# Altium schematic sheet ZynqPS.SchDoc: ZynqProcessorSystem
size A3; Author: Carlos Barreiro; Organization: Escuela Técnica Superior de Ingeniería de Sistemas Informáticos de la Universidad Politécnica de Madrid; Address1: Campus Sur de la Universidad Politécnica de Madrid; Address2: Calle de Alan Turing, s/nº; Address3: Madrid 28031; Address4: España; DocumentNumber: 3; Revision: A; SheetNumber: 3; SheetTotal: 16
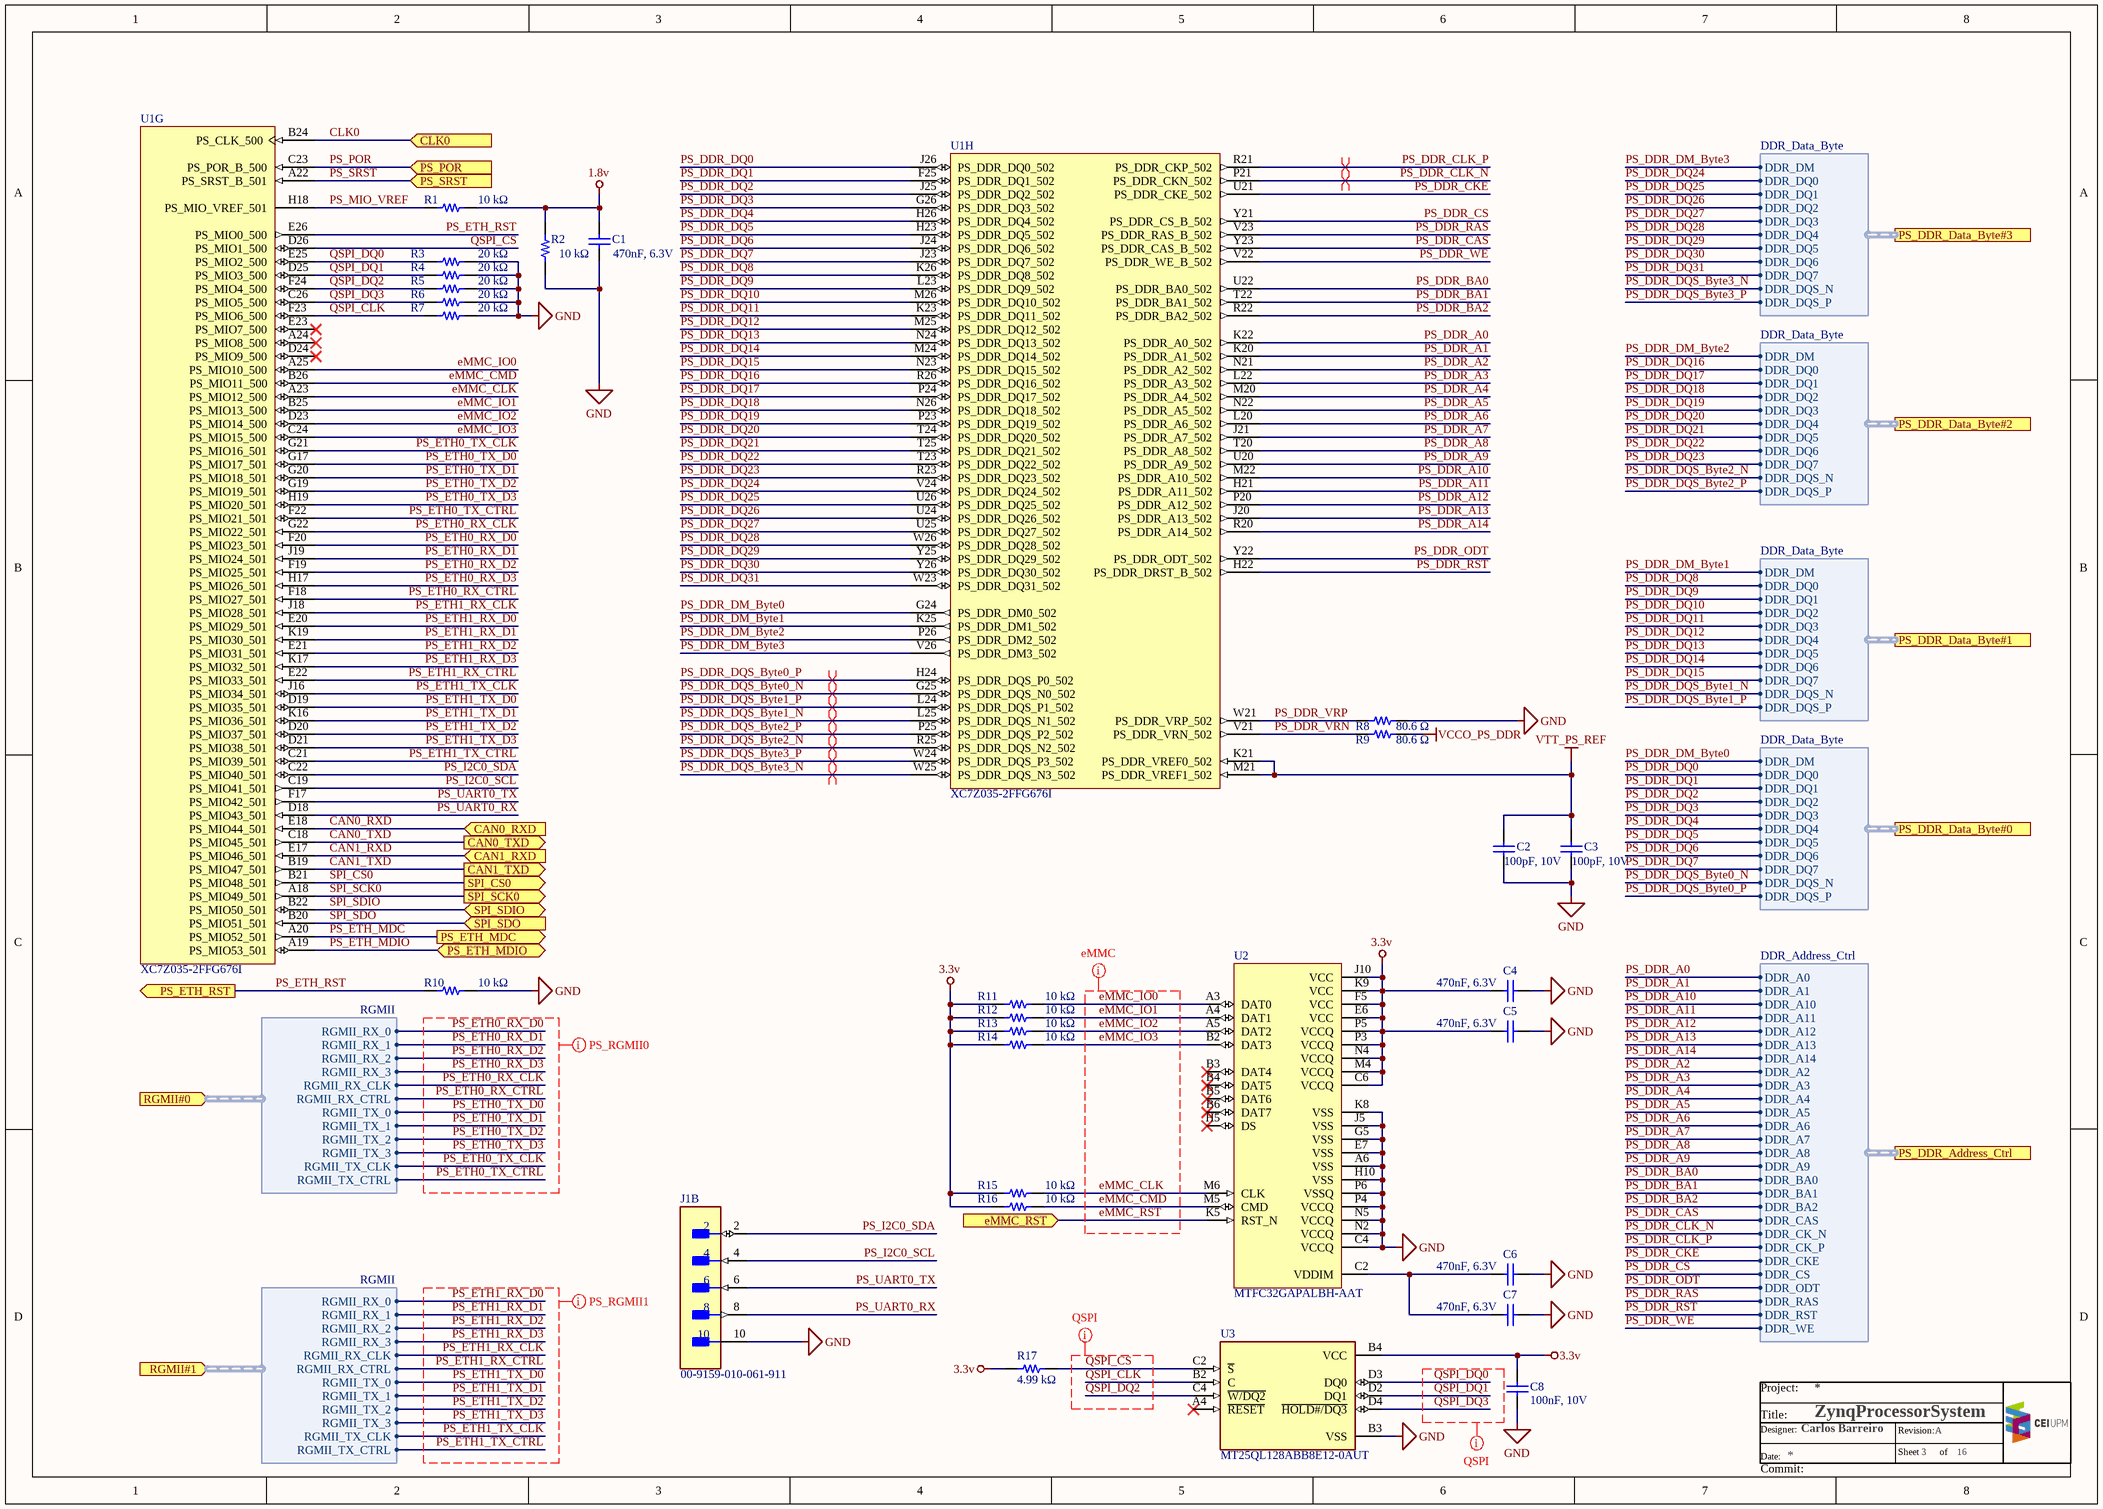
[diagram p0: ZynqPS.SchDoc]

## Parts
C1  470nF, 6.3V  [WURTH_WCAP-CSGP_0402]
C2  100pF, 10V  [WURTH_WCAP-CSGP_0402]
C3  100pF, 10V  [WURTH_WCAP-CSGP_0402]
C4  470nF, 6.3V  [WURTH_WCAP-CSGP_0402]
C5  470nF, 6.3V  [WURTH_WCAP-CSGP_0402]
C6  470nF, 6.3V  [WURTH_WCAP-CSGP_0402]
C7  470nF, 6.3V  [WURTH_WCAP-CSGP_0402]
C8  100nF, 10V  [WURTH_WCAP-CSGP_0402]
J1  00-9159-010-061-911  [KYOCERA_00-9159-010-061-911]  (part B of 2)
R1  10 kΩ  [PANASONIC_ERJ2G_0402]
R2  10 kΩ  [PANASONIC_ERJ2G_0402]
R3  20 kΩ  [PANASONIC_ERJ2G_0402]
R4  20 kΩ  [PANASONIC_ERJ2G_0402]
R5  20 kΩ  [PANASONIC_ERJ2G_0402]
R6  20 kΩ  [PANASONIC_ERJ2G_0402]
R7  20 kΩ  [PANASONIC_ERJ2G_0402]
R8  80.6 Ω  [PANASONIC_ERJ2G_0402]
R9  80.6 Ω  [PANASONIC_ERJ2G_0402]
R10  10 kΩ  [PANASONIC_ERJ2G_0402]
R11  10 kΩ  [PANASONIC_ERJ2G_0402]
R12  10 kΩ  [PANASONIC_ERJ2G_0402]
R13  10 kΩ  [PANASONIC_ERJ2G_0402]
R14  10 kΩ  [PANASONIC_ERJ2G_0402]
R15  10 kΩ  [PANASONIC_ERJ2G_0402]
R16  10 kΩ  [PANASONIC_ERJ2G_0402]
R17  4.99 kΩ  [PANASONIC_ERJ2G_0402]
U1  XC7Z035-2FFG676I  [XILINX_FBG676]  (parts G,H of 13)
U2  MTFC32GAPALBH-AAT  [Micron_BH]
U3  MT25QL128ABB8E12-0AUT  [Micron_RW]

## Ports
CAN0_RXD (in), CAN0_TXD (out), CAN1_RXD (in), CAN1_TXD (out), CLK0 (in), eMMC_RST (in), PS_DDR_Address_Ctrl (harness DDR_Address_Ctrl), PS_DDR_Data_Byte#0 (harness DDR_Data_Byte), PS_DDR_Data_Byte#1 (harness DDR_Data_Byte), PS_DDR_Data_Byte#2 (harness DDR_Data_Byte), PS_DDR_Data_Byte#3 (harness DDR_Data_Byte), PS_ETH_MDC (out), PS_ETH_MDIO (bidir), PS_ETH_RST (out), PS_POR (in), PS_SRST (in), RGMII#0 (in, harness RGMII), RGMII#1 (in, harness RGMII), SPI_CS0 (out), SPI_SCK0 (out), SPI_SDIO (bidir), SPI_SDO (in)

## Harnesses
DDR_Address_Ctrl: DDR_A0, DDR_A1, DDR_A10, DDR_A11, DDR_A12, DDR_A13, DDR_A14, DDR_A2, DDR_A3, DDR_A4, DDR_A5, DDR_A6, DDR_A7, DDR_A8, DDR_A9, DDR_BA0, DDR_BA1, DDR_BA2, DDR_CAS, DDR_CK_N, DDR_CK_P, DDR_CKE, DDR_CS, DDR_ODT, DDR_RAS, DDR_RST, DDR_WE
DDR_Data_Byte: DDR_DM, DDR_DQ0, DDR_DQ1, DDR_DQ2, DDR_DQ3, DDR_DQ4, DDR_DQ5, DDR_DQ6, DDR_DQ7, DDR_DQS_N, DDR_DQS_P
RGMII: RGMII_RX_0, RGMII_RX_1, RGMII_RX_2, RGMII_RX_3, RGMII_RX_CLK, RGMII_RX_CTRL, RGMII_TX_0, RGMII_TX_1, RGMII_TX_2, RGMII_TX_3, RGMII_TX_CLK, RGMII_TX_CTRL

## Nets
1.8v: C1.1 R1.1 R2.2
3.3v: C4.1 C5.1 C8.2 R11.2 R12.2 R13.2 R14.2 R15.2 R16.2 R17.1 U2.C6(VCCQ) U2.E6(VCC) U2.F5(VCC) U2.J10(VCC) U2.K9(VCC) U2.M4(VCCQ) U2.N4(VCCQ) U2.P3(VCCQ) U2.P5(VCCQ) U3.B4(VCC)
GND: C1.2 C2.1 C3.1 C4.2 C5.2 C6.2 C7.2 C8.1 J1.10 R2.1 R3.2 R4.2 R5.2 R6.2 R7.2 R8.2 R10.1 U2.A6(VSS) U2.C4(VCCQ) U2.E7(VSS) U2.G5(VSS) U2.H10(VSS) U2.J5(VSS) U2.K8(VSS) U2.N2(VCCQ) U2.N5(VCCQ) U2.P4(VCCQ) U2.P6(VSSQ) U3.B3(VSS)
VCCO_PS_DDR: R9.2
VTT_PS_REF: C2.2 C3.2 U1.K21(PS_DDR_VREF0_502) U1.M21(PS_DDR_VREF1_502)
CAN0_RXD: U1.E18(PS_MIO44_501) ; port CAN0_RXD
CAN0_TXD: U1.C18(PS_MIO45_501) ; port CAN0_TXD
CAN1_RXD: U1.E17(PS_MIO46_501) ; port CAN1_RXD
CAN1_TXD: U1.B19(PS_MIO47_501) ; port CAN1_TXD
CLK0: U1.B24(PS_CLK_500) ; port CLK0
eMMC_CLK: R15.1 U1.A23(PS_MIO12_500) U2.M6(CLK)
eMMC_CMD: R16.1 U1.B26(PS_MIO11_500) U2.M5(CMD)
eMMC_IO0: R11.1 U1.A25(PS_MIO10_500) U2.A3(DAT0)
eMMC_IO1: R12.1 U1.B25(PS_MIO13_500) U2.A4(DAT1)
eMMC_IO2: R13.1 U1.D23(PS_MIO14_500) U2.A5(DAT2)
eMMC_IO3: R14.1 U1.C24(PS_MIO15_500) U2.B2(DAT3)
eMMC_RST: U2.K5(RST_N) ; port eMMC_RST
PS_DDR_A0: U1.K22(PS_DDR_A0_502) ; port PS_DDR_Address_Ctrl.DDR_A0
PS_DDR_A1: U1.K20(PS_DDR_A1_502) ; port PS_DDR_Address_Ctrl.DDR_A1
PS_DDR_A2: U1.N21(PS_DDR_A2_502) ; port PS_DDR_Address_Ctrl.DDR_A2
PS_DDR_A3: U1.L22(PS_DDR_A3_502) ; port PS_DDR_Address_Ctrl.DDR_A3
PS_DDR_A4: U1.M20(PS_DDR_A4_502) ; port PS_DDR_Address_Ctrl.DDR_A4
PS_DDR_A5: U1.N22(PS_DDR_A5_502) ; port PS_DDR_Address_Ctrl.DDR_A5
PS_DDR_A6: U1.L20(PS_DDR_A6_502) ; port PS_DDR_Address_Ctrl.DDR_A6
PS_DDR_A7: U1.J21(PS_DDR_A7_502) ; port PS_DDR_Address_Ctrl.DDR_A7
PS_DDR_A8: U1.T20(PS_DDR_A8_502) ; port PS_DDR_Address_Ctrl.DDR_A8
PS_DDR_A9: U1.U20(PS_DDR_A9_502) ; port PS_DDR_Address_Ctrl.DDR_A9
PS_DDR_A10: U1.M22(PS_DDR_A10_502) ; port PS_DDR_Address_Ctrl.DDR_A10
PS_DDR_A11: U1.H21(PS_DDR_A11_502) ; port PS_DDR_Address_Ctrl.DDR_A11
PS_DDR_A12: U1.P20(PS_DDR_A12_502) ; port PS_DDR_Address_Ctrl.DDR_A12
PS_DDR_A13: U1.J20(PS_DDR_A13_502) ; port PS_DDR_Address_Ctrl.DDR_A13
PS_DDR_A14: U1.R20(PS_DDR_A14_502) ; port PS_DDR_Address_Ctrl.DDR_A14
PS_DDR_BA0: U1.U22(PS_DDR_BA0_502) ; port PS_DDR_Address_Ctrl.DDR_BA0
PS_DDR_BA1: U1.T22(PS_DDR_BA1_502) ; port PS_DDR_Address_Ctrl.DDR_BA1
PS_DDR_BA2: U1.R22(PS_DDR_BA2_502) ; port PS_DDR_Address_Ctrl.DDR_BA2
PS_DDR_CAS: U1.Y23(PS_DDR_CAS_B_502) ; port PS_DDR_Address_Ctrl.DDR_CAS
PS_DDR_CKE: U1.U21(PS_DDR_CKE_502) ; port PS_DDR_Address_Ctrl.DDR_CKE
PS_DDR_CLK_N: U1.P21(PS_DDR_CKN_502) ; port PS_DDR_Address_Ctrl.DDR_CK_N
PS_DDR_CLK_P: U1.R21(PS_DDR_CKP_502) ; port PS_DDR_Address_Ctrl.DDR_CK_P
PS_DDR_CS: U1.Y21(PS_DDR_CS_B_502) ; port PS_DDR_Address_Ctrl.DDR_CS
PS_DDR_DM_Byte0: U1.G24(PS_DDR_DM0_502) ; port PS_DDR_Data_Byte#0.DDR_DM
PS_DDR_DM_Byte1: U1.K25(PS_DDR_DM1_502) ; port PS_DDR_Data_Byte#1.DDR_DM
PS_DDR_DM_Byte2: U1.P26(PS_DDR_DM2_502) ; port PS_DDR_Data_Byte#2.DDR_DM
PS_DDR_DM_Byte3: U1.V26(PS_DDR_DM3_502) ; port PS_DDR_Data_Byte#3.DDR_DM
PS_DDR_DQ0: U1.J26(PS_DDR_DQ0_502) ; port PS_DDR_Data_Byte#0.DDR_DQ0
PS_DDR_DQ1: U1.F25(PS_DDR_DQ1_502) ; port PS_DDR_Data_Byte#0.DDR_DQ1
PS_DDR_DQ2: U1.J25(PS_DDR_DQ2_502) ; port PS_DDR_Data_Byte#0.DDR_DQ2
PS_DDR_DQ3: U1.G26(PS_DDR_DQ3_502) ; port PS_DDR_Data_Byte#0.DDR_DQ3
PS_DDR_DQ4: U1.H26(PS_DDR_DQ4_502) ; port PS_DDR_Data_Byte#0.DDR_DQ4
PS_DDR_DQ5: U1.H23(PS_DDR_DQ5_502) ; port PS_DDR_Data_Byte#0.DDR_DQ5
PS_DDR_DQ6: U1.J24(PS_DDR_DQ6_502) ; port PS_DDR_Data_Byte#0.DDR_DQ6
PS_DDR_DQ7: U1.J23(PS_DDR_DQ7_502) ; port PS_DDR_Data_Byte#0.DDR_DQ7
PS_DDR_DQ8: U1.K26(PS_DDR_DQ8_502) ; port PS_DDR_Data_Byte#1.DDR_DQ0
PS_DDR_DQ9: U1.L23(PS_DDR_DQ9_502) ; port PS_DDR_Data_Byte#1.DDR_DQ1
PS_DDR_DQ10: U1.M26(PS_DDR_DQ10_502) ; port PS_DDR_Data_Byte#1.DDR_DQ2
PS_DDR_DQ11: U1.K23(PS_DDR_DQ11_502) ; port PS_DDR_Data_Byte#1.DDR_DQ3
PS_DDR_DQ12: U1.M25(PS_DDR_DQ12_502) ; port PS_DDR_Data_Byte#1.DDR_DQ4
PS_DDR_DQ13: U1.N24(PS_DDR_DQ13_502) ; port PS_DDR_Data_Byte#1.DDR_DQ5
PS_DDR_DQ14: U1.M24(PS_DDR_DQ14_502) ; port PS_DDR_Data_Byte#1.DDR_DQ6
PS_DDR_DQ15: U1.N23(PS_DDR_DQ15_502) ; port PS_DDR_Data_Byte#1.DDR_DQ7
PS_DDR_DQ16: U1.R26(PS_DDR_DQ16_502) ; port PS_DDR_Data_Byte#2.DDR_DQ0
PS_DDR_DQ17: U1.P24(PS_DDR_DQ17_502) ; port PS_DDR_Data_Byte#2.DDR_DQ1
PS_DDR_DQ18: U1.N26(PS_DDR_DQ18_502) ; port PS_DDR_Data_Byte#2.DDR_DQ2
PS_DDR_DQ19: U1.P23(PS_DDR_DQ19_502) ; port PS_DDR_Data_Byte#2.DDR_DQ3
PS_DDR_DQ20: U1.T24(PS_DDR_DQ20_502) ; port PS_DDR_Data_Byte#2.DDR_DQ4
PS_DDR_DQ21: U1.T25(PS_DDR_DQ21_502) ; port PS_DDR_Data_Byte#2.DDR_DQ5
PS_DDR_DQ22: U1.T23(PS_DDR_DQ22_502) ; port PS_DDR_Data_Byte#2.DDR_DQ6
PS_DDR_DQ23: U1.R23(PS_DDR_DQ23_502) ; port PS_DDR_Data_Byte#2.DDR_DQ7
PS_DDR_DQ24: U1.V24(PS_DDR_DQ24_502) ; port PS_DDR_Data_Byte#3.DDR_DQ0
PS_DDR_DQ25: U1.U26(PS_DDR_DQ25_502) ; port PS_DDR_Data_Byte#3.DDR_DQ1
PS_DDR_DQ26: U1.U24(PS_DDR_DQ26_502) ; port PS_DDR_Data_Byte#3.DDR_DQ2
PS_DDR_DQ27: U1.U25(PS_DDR_DQ27_502) ; port PS_DDR_Data_Byte#3.DDR_DQ3
PS_DDR_DQ28: U1.W26(PS_DDR_DQ28_502) ; port PS_DDR_Data_Byte#3.DDR_DQ4
PS_DDR_DQ29: U1.Y25(PS_DDR_DQ29_502) ; port PS_DDR_Data_Byte#3.DDR_DQ5
PS_DDR_DQ30: U1.Y26(PS_DDR_DQ30_502) ; port PS_DDR_Data_Byte#3.DDR_DQ6
PS_DDR_DQ31: U1.W23(PS_DDR_DQ31_502) ; port PS_DDR_Data_Byte#3.DDR_DQ7
PS_DDR_DQS_Byte0_N: U1.G25(PS_DDR_DQS_N0_502) ; port PS_DDR_Data_Byte#0.DDR_DQS_N
PS_DDR_DQS_Byte0_P: U1.H24(PS_DDR_DQS_P0_502) ; port PS_DDR_Data_Byte#0.DDR_DQS_P
PS_DDR_DQS_Byte1_N: U1.L25(PS_DDR_DQS_N1_502) ; port PS_DDR_Data_Byte#1.DDR_DQS_N
PS_DDR_DQS_Byte1_P: U1.L24(PS_DDR_DQS_P1_502) ; port PS_DDR_Data_Byte#1.DDR_DQS_P
PS_DDR_DQS_Byte2_N: U1.R25(PS_DDR_DQS_N2_502) ; port PS_DDR_Data_Byte#2.DDR_DQS_N
PS_DDR_DQS_Byte2_P: U1.P25(PS_DDR_DQS_P2_502) ; port PS_DDR_Data_Byte#2.DDR_DQS_P
PS_DDR_DQS_Byte3_N: U1.W25(PS_DDR_DQS_N3_502) ; port PS_DDR_Data_Byte#3.DDR_DQS_N
PS_DDR_DQS_Byte3_P: U1.W24(PS_DDR_DQS_P3_502) ; port PS_DDR_Data_Byte#3.DDR_DQS_P
PS_DDR_ODT: U1.Y22(PS_DDR_ODT_502) ; port PS_DDR_Address_Ctrl.DDR_ODT
PS_DDR_RAS: U1.V23(PS_DDR_RAS_B_502) ; port PS_DDR_Address_Ctrl.DDR_RAS
PS_DDR_RST: U1.H22(PS_DDR_DRST_B_502) ; port PS_DDR_Address_Ctrl.DDR_RST
PS_DDR_VRN: R9.1 U1.V21(PS_DDR_VRN_502)
PS_DDR_VRP: R8.1 U1.W21(PS_DDR_VRP_502)
PS_DDR_WE: U1.V22(PS_DDR_WE_B_502) ; port PS_DDR_Address_Ctrl.DDR_WE
PS_ETH0_RX_CLK: U1.G22(PS_MIO22_501) ; port RGMII#0.RGMII_RX_CLK
PS_ETH0_RX_CTRL: U1.F18(PS_MIO27_501) ; port RGMII#0.RGMII_RX_CTRL
PS_ETH0_RX_D0: U1.F20(PS_MIO23_501) ; port RGMII#0.RGMII_RX_0
PS_ETH0_RX_D1: U1.J19(PS_MIO24_501) ; port RGMII#0.RGMII_RX_1
PS_ETH0_RX_D2: U1.F19(PS_MIO25_501) ; port RGMII#0.RGMII_RX_2
PS_ETH0_RX_D3: U1.H17(PS_MIO26_501) ; port RGMII#0.RGMII_RX_3
PS_ETH0_TX_CLK: U1.G21(PS_MIO16_501) ; port RGMII#0.RGMII_TX_CLK
PS_ETH0_TX_CTRL: U1.F22(PS_MIO21_501) ; port RGMII#0.RGMII_TX_CTRL
PS_ETH0_TX_D0: U1.G17(PS_MIO17_501) ; port RGMII#0.RGMII_TX_0
PS_ETH0_TX_D1: U1.G20(PS_MIO18_501) ; port RGMII#0.RGMII_TX_1
PS_ETH0_TX_D2: U1.G19(PS_MIO19_501) ; port RGMII#0.RGMII_TX_2
PS_ETH0_TX_D3: U1.H19(PS_MIO20_501) ; port RGMII#0.RGMII_TX_3
PS_ETH1_RX_CLK: U1.J18(PS_MIO28_501) ; port RGMII#1.RGMII_RX_CLK
PS_ETH1_RX_CTRL: U1.E22(PS_MIO33_501) ; port RGMII#1.RGMII_RX_CTRL
PS_ETH1_RX_D0: U1.E20(PS_MIO29_501) ; port RGMII#1.RGMII_RX_0
PS_ETH1_RX_D1: U1.K19(PS_MIO30_501) ; port RGMII#1.RGMII_RX_1
PS_ETH1_RX_D2: U1.E21(PS_MIO31_501) ; port RGMII#1.RGMII_RX_2
PS_ETH1_RX_D3: U1.K17(PS_MIO32_501) ; port RGMII#1.RGMII_RX_3
PS_ETH1_TX_CLK: U1.J16(PS_MIO34_501) ; port RGMII#1.RGMII_TX_CLK
PS_ETH1_TX_CTRL: U1.C21(PS_MIO39_501) ; port RGMII#1.RGMII_TX_CTRL
PS_ETH1_TX_D0: U1.D19(PS_MIO35_501) ; port RGMII#1.RGMII_TX_0
PS_ETH1_TX_D1: U1.K16(PS_MIO36_501) ; port RGMII#1.RGMII_TX_1
PS_ETH1_TX_D2: U1.D20(PS_MIO37_501) ; port RGMII#1.RGMII_TX_2
PS_ETH1_TX_D3: U1.D21(PS_MIO38_501) ; port RGMII#1.RGMII_TX_3
PS_ETH_MDC: U1.A20(PS_MIO52_501) ; port PS_ETH_MDC
PS_ETH_MDIO: U1.A19(PS_MIO53_501) ; port PS_ETH_MDIO
PS_ETH_RST: R10.2 U1.E26(PS_MIO0_500) ; port PS_ETH_RST
PS_I2C0_SCL: J1.4 U1.C19(PS_MIO41_501)
PS_I2C0_SDA: J1.2 U1.C22(PS_MIO40_501)
PS_MIO_VREF: R1.2 U1.H18(PS_MIO_VREF_501)
PS_POR: U1.C23(PS_POR_B_500) ; port PS_POR
PS_SRST: U1.A22(PS_SRST_B_501) ; port PS_SRST
PS_UART0_RX: J1.8 U1.D18(PS_MIO43_501)
PS_UART0_TX: J1.6 U1.F17(PS_MIO42_501)
QSPI_CLK: R7.1 U1.F23(PS_MIO6_500) U3.B2(C)
QSPI_CS: R17.2 U1.D26(PS_MIO1_500) U3.C2(~{S})
QSPI_DQ0: R3.1 U1.E25(PS_MIO2_500) U3.D3(DQ0)
QSPI_DQ1: R4.1 U1.D25(PS_MIO3_500) U3.D2(DQ1)
QSPI_DQ2: R5.1 U1.F24(PS_MIO4_500) U3.C4(~{W/DQ2})
QSPI_DQ3: R6.1 U1.C26(PS_MIO5_500) U3.D4(~{HOLD#/DQ3})
SPI_CS0: U1.B21(PS_MIO48_501) ; port SPI_CS0
SPI_SCK0: U1.A18(PS_MIO49_501) ; port SPI_SCK0
SPI_SDIO: U1.B22(PS_MIO50_501) ; port SPI_SDIO
SPI_SDO: U1.B20(PS_MIO51_501) ; port SPI_SDO
NetC6_1: C6.1 C7.1 U2.C2(VDDIM)

Not connected (* = marked no-connect by the designer): U1 A24(PS_MIO8_500)* D24(PS_MIO9_500)* E23(PS_MIO7_500)*; U2 B3(DAT4)* B4(DAT5)* B5(DAT6)* B6(DAT7)* H5(DS)*; U3 A4(~{RESET})*

## Layout directives
differential pair: PS_DDR_CLK_N, PS_DDR_CLK_P, PS_DDR_DQS_Byte0_N, PS_DDR_DQS_Byte0_P, PS_DDR_DQS_Byte1_N, PS_DDR_DQS_Byte1_P, PS_DDR_DQS_Byte2_N, PS_DDR_DQS_Byte2_P, PS_DDR_DQS_Byte3_N, PS_DDR_DQS_Byte3_P
net class PS_RGMII0: PS_ETH0_RX_CLK, PS_ETH0_RX_CTRL, PS_ETH0_RX_D0, PS_ETH0_RX_D1, PS_ETH0_RX_D2, PS_ETH0_RX_D3, PS_ETH0_TX_CLK, PS_ETH0_TX_CTRL, PS_ETH0_TX_D0, PS_ETH0_TX_D1, PS_ETH0_TX_D2, PS_ETH0_TX_D3
net class PS_RGMII1: PS_ETH1_RX_CLK, PS_ETH1_RX_CTRL, PS_ETH1_RX_D0, PS_ETH1_RX_D1, PS_ETH1_RX_D2, PS_ETH1_RX_D3, PS_ETH1_TX_CLK, PS_ETH1_TX_CTRL, PS_ETH1_TX_D0, PS_ETH1_TX_D1, PS_ETH1_TX_D2, PS_ETH1_TX_D3
net class QSPI: QSPI_CLK, QSPI_CS, QSPI_DQ0, QSPI_DQ1, QSPI_DQ2, QSPI_DQ3
net class eMMC: eMMC_CLK, eMMC_CMD, eMMC_IO0, eMMC_IO1, eMMC_IO2, eMMC_IO3, eMMC_RST

## Notes on the sheet
- Project:
- Title:
- Date:
- Designer:
- Sheet
- Revision:
- of
- Commit:

## Library data of the parts
C1 C4-C7 = 885012105004: WCAP-CSGP Multilayer Ceramic Chip Capacitor, General Purpose, size 0402, X5R, 470nF, 6.3V; Manufacturer: Wurth Elektronik; Rated Voltage: 6.3VDC; Isolation Resistance  min.: 0.2GOhm; Capacitance Tolerance: +/-20%; Dissipation Factor max.: 10%; Technical Reference: X5R0402474M6R3DFCT10000; ComponentLink1Description: Manufacturer; ComponentLink1URL: http://www.we-online.de; ComponentLink2Description: Datasheet; ComponentLink2URL: https://www.we-online.com/catalog/datasheet/885012105004.pdf; Operating Temperature: -55 to +85degC; Packaging: Tape and Reel; Manufacturer Part Number: 885012105004; Published Date: April 2021; Ceramic Type: X5R; Height: 0.5mm; Mounting Technology: SMT; Size: 0402; Capacitance: 470nF; Supplier 1: Digi-Key; Supplier 2: Mouser; Supplier Part Number 1: 732-7481-1-ND; Supplier Part Number 2: 710-885012105004
C2 C3 = 885012005013: WCAP-CSGP Multilayer Ceramic Chip Capacitor, General Purpose, size 0402, NP0, 100pF, 10V; Manufacturer: Wurth Elektronik; Rated Voltage: 10VDC; Isolation Resistance  min.: 10GOhm; Capacitance Tolerance: +/-5%; Technical Reference: NP00402101J010DFCT10000; Q-Factor min.: 1000; ComponentLink1Description: Manufacturer; ComponentLink1URL: http://www.we-online.de; ComponentLink2Description: Datasheet; ComponentLink2URL: https://www.we-online.com/catalog/datasheet/885012005013.pdf; Operating Temperature: -55 to +125degC; Packaging: Tape and Reel; Manufacturer Part Number: 885012005013; Published Date: April 2021; Ceramic Type: NP0; Dissipation Factor max.: -; Height: 0.5mm; Mounting Technology: SMT; Size: 0402; Capacitance: 100pF
C8 = 885012205018: WCAP-CSGP Multilayer Ceramic Chip Capacitor, General Purpose, size 0402, X7R, 100nF, 10V; Manufacturer: Wurth Elektronik; Rated Voltage: 10VDC; Isolation Resistance  min.: 5GOhm; Capacitance Tolerance: +/-10%; Dissipation Factor max.: 5%; Technical Reference: X7R0402104K010DFCT10000; ComponentLink1Description: Manufacturer; ComponentLink1URL: http://www.we-online.de; ComponentLink2Description: Datasheet; ComponentLink2URL: https://www.we-online.com/catalog/datasheet/885012205018.pdf; Operating Temperature: -55 to +125degC; Packaging: Tape and Reel; Manufacturer Part Number: 885012205018; Published Date: April 2021; Ceramic Type: X7R; Height: 0.5mm; Mounting Technology: SMT; Size: 0402; Capacitance: 100nF; Q-Factor min.: -
J1 = 00-9159-010-061-911: Coplanar Open Ended Card Edge Connector 10 Pin; Supplier 1: Digi-Key; Supplier Part Number 1: 478-009159010061911-ND
R1 R2 R10-R16 = ERJ2RKF1002X: General Purpose Thick Film Chip Resistors; Manufacturer: Panasonic; Power (0402): 0.1 W; Limiting Voltage (0402): 50; Maximum Voltage (0402): 100; Resistance Range (Ω): 1Ω to 100MΩ; AEC 200: Grade 0; Size (0402): 2GE; ComponentLink1Description: Catalog; ComponentLink1URL: https://industrial.panasonic.com/ww/products/pt/general-purpose-chip-resistors/models?op=search&model_status_current=1&page=0#model-list-search-results; Series: ERJ; Temperature Range (ºC): -55 to +155; Supplier 1: Digi-Key; Supplier 2: Mouser; Supplier Part Number 1: P10.0KLCT-ND; Supplier Part Number 2: 667-ERJ-2RKF1002X
R3-R7 = ERJ2RKF2002X: General Purpose Thick Film Chip Resistors; Manufacturer: Panasonic; Power (0402): 0.1 W; Limiting Voltage (0402): 50; Maximum Voltage (0402): 100; Resistance Range (Ω): 1Ω to 100MΩ; AEC 200: Grade 0; Size (0402): 2GE; ComponentLink1Description: Catalog; ComponentLink1URL: https://industrial.panasonic.com/ww/products/pt/general-purpose-chip-resistors/models?op=search&model_status_current=1&page=0#model-list-search-results; Series: ERJ; Temperature Range (ºC): -55 to +155; Supplier 1: Digi-Key; Supplier Part Number 1: P20.0KLCT-ND
R8 R9 = ERJ2RKF80R6X: General Purpose Thick Film Chip Resistors; Manufacturer: Panasonic; Power (0402): 0.1 W; Limiting Voltage (0402): 50; Maximum Voltage (0402): 100; Resistance Range (Ω): 1Ω to 100MΩ; AEC 200: Grade 0; Size (0402): 2GE; ComponentLink1Description: Catalog; ComponentLink1URL: https://industrial.panasonic.com/ww/products/pt/general-purpose-chip-resistors/models?op=search&model_status_current=1&page=0#model-list-search-results; Series: ERJ; Temperature Range (ºC): -55 to +155; Supplier 1: Digi-Key; Supplier 2: Mouser; Supplier Part Number 1: P80.6LCT-ND; Supplier Part Number 2: 667-ERJ-2RKF80R6X
R17 = ERJ2RKF4991X: General Purpose Thick Film Chip Resistors; Manufacturer: Panasonic; Power (0402): 0.1 W; Limiting Voltage (0402): 50; Maximum Voltage (0402): 100; Resistance Range (Ω): 1Ω to 100MΩ; AEC 200: Grade 0; Size (0402): 2GE; ComponentLink1Description: Catalog; ComponentLink1URL: https://industrial.panasonic.com/ww/products/pt/general-purpose-chip-resistors/models?op=search&model_status_current=1&page=0#model-list-search-results; Series: ERJ; Temperature Range (ºC): -55 to +155; Supplier 1: Digi-Key; Supplier Part Number 1: P4.99KLTR-ND
U1 = XC7Z035-2FFG676I: 667 MHz Zynq™-7000 AP SoC, 130 PS I/O, 254 FPGA I/O, 676-Ball BGA, Speed Grade 1, Commercial Grade, Pb-Free; PartNumber: XC7Z035-2FBG676I; LUTs: 171,900; Extensible Block RAM (# 36Kb Blocks): 17.6Mb (500); Speed Grade: -2; Flip Flops: 343,800; ComponentLink5Description: Packaging and Pinout; ComponentLink4Description: Package File; ComponentLink5URL: http://www.xilinx.com/support/documentation/user_guides/ug865-Zynq-7000-Pkg-Pinout.pdf; Generic Part Number: XC7Z035; ComponentLink1Description: Datasheet; ComponentLink2Description: Package Specification; ComponentLink3URL: http://www.xilinx.com/support/documentation/data_sheets/ds191-XC7Z030-XC7Z045-data-sheet.pdf; ComponentLink1URL: http://www.xilinx.com/support/documentation/data_sheets/ds190-Zynq-7000-Overview.pdf; ComponentLink6Description: PCB and Layout Guide; Package: FBG676; ComponentLink3Description: DC and AC Switching Characteristics; ComponentLink6URL: http://www.xilinx.com/support/documentation/user_guides/ug483_7Series_PCB.pdf; RoHS: Pb-Free; ComponentLink4URL: http://www.xilinx.com/support/packagefiles/z7packages/xc7z030fbg676pkg.txt; ComponentLink2URL: http://www.xilinx.com/support/documentation/user_guides/ug475_7Series_Pkg_Pinout.pdf; PackageDescription: Flip-Chip Lidless BGA, Body 27 x 27 mm, 1.0 mm Pitch; Supplier 1: Digi-Key; Supplier 2: Mouser; Supplier Part Number 1: XC7Z035-2FFG676I-ND; Supplier Part Number 2: 217-XC7Z035-2FFG676I
U2 = MTFC32GAPALBH-AAT: Flash Memory Managed NAND e.MMC Automotive 32GB; MF: Micron Technology; FBGA Code: JWC65; Nominal Supply Voltage (DC): 3.3 V; Density: Density; Package: TFBGA; Operating Temperature: -40ºC to +105ºC; Width: x8; Part Status: Production; ComponentLink1Description: Manufacturer URL; ComponentLink1URL: http://www.micron.com/; Supplier 1: Digi-Key; Supplier 2: Mouser; Supplier Part Number 1: MTFC32GAPALBH-AAT-ND; Supplier Part Number 2: 340-349173-TRAY
U3 = MT25QL128ABB8E12-0AUT: NOR Serial Flash Memory 128Mb 3.3V Multiple I/O Automotive; MF: Micron Technology; FBGA Code: RW318; Density: 128Mb; Operating Temperature: -40ºC to +125ºC; Package: T-PBGA; Type: Multi I/O; Width: x1/x2/x4; Nominal Supply Voltage (DC): 3.3 V; Part Status: Production; ComponentLink1Description: Manufacturer URL; ComponentLink1URL: http://www.micron.com/; Supplier 1: Digi-Key; Supplier 2: Mouser; Supplier Part Number 1: MT25QL128ABB8E12-0AUT-ND; Supplier Part Number 2: 340-348677